# Altium schematic sheet 7seg.SchDoc
size A4
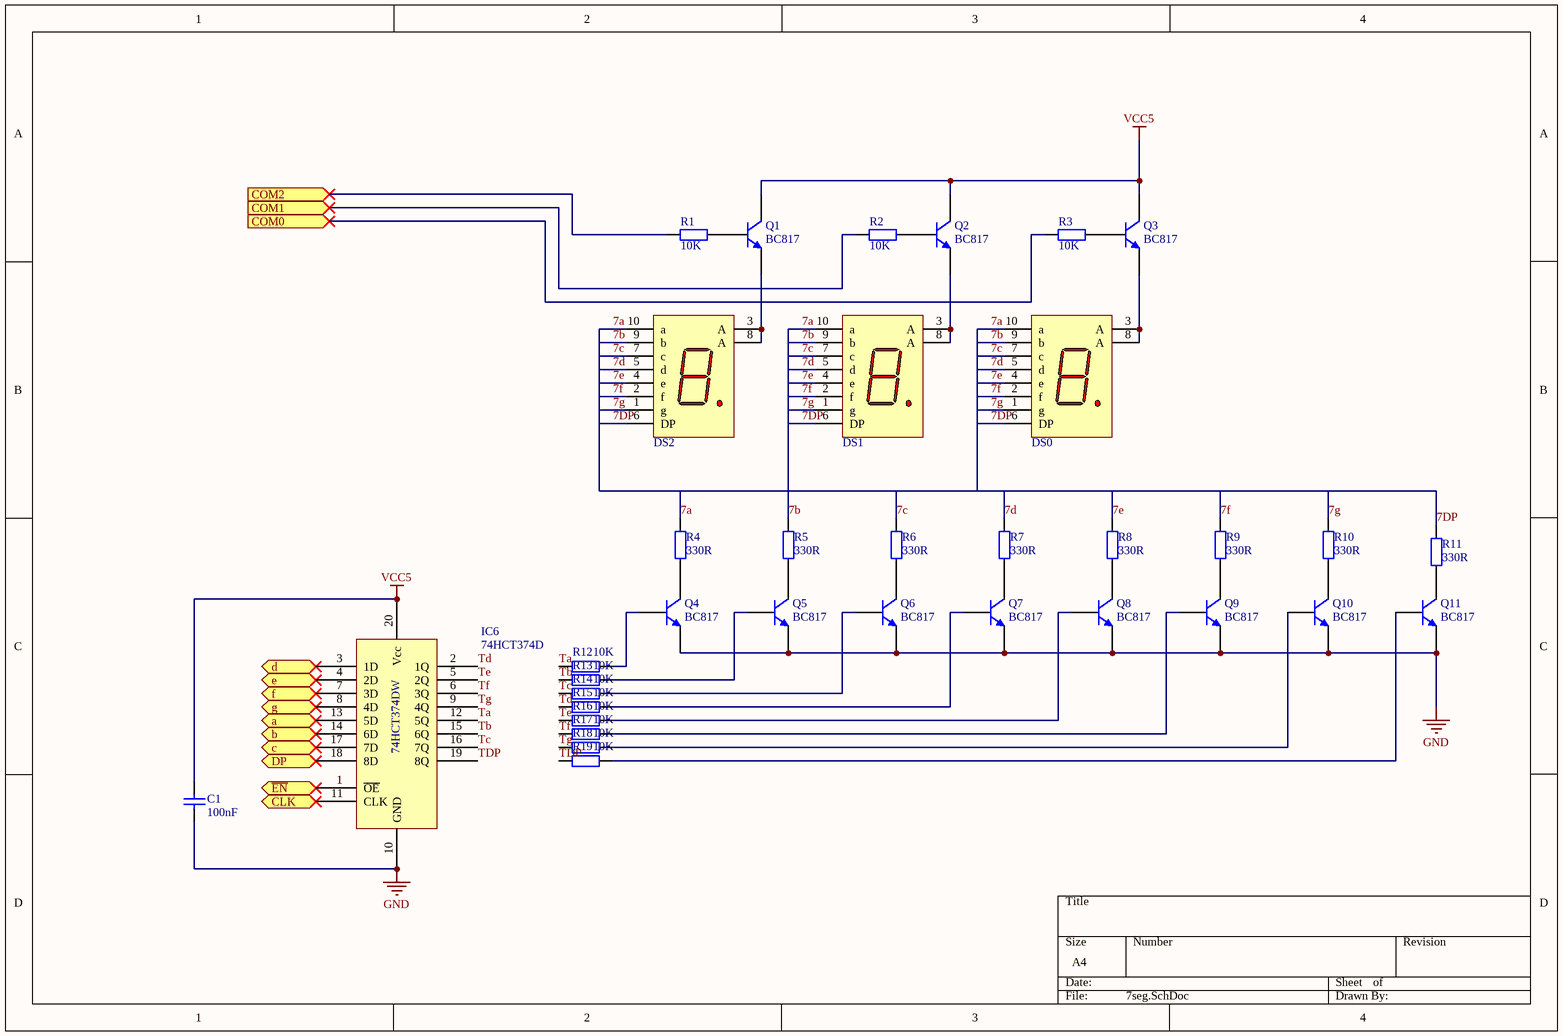
[diagram p0: 7seg.SchDoc]

## Parts
C1  100nF  [FP_0805_CAP_085]
DS0  7SEG  [FP_7SEG]  (value not drawn)
DS1  7SEG  [FP_7SEG]  (value not drawn)
DS2  7SEG  [FP_7SEG]  (value not drawn)
IC6  74HCT374D  [SOP20]
Q1  BC817  [FP_SOT23-3]
Q2  BC817  [FP_SOT23-3]
Q3  BC817  [FP_SOT23-3]
Q4  BC817  [FP_SOT23-3]
Q5  BC817  [FP_SOT23-3]
Q6  BC817  [FP_SOT23-3]
Q7  BC817  [FP_SOT23-3]
Q8  BC817  [FP_SOT23-3]
Q9  BC817  [FP_SOT23-3]
Q10  BC817  [FP_SOT23-3]
Q11  BC817  [FP_SOT23-3]
R1  10K  [FP_0805_RES]
R2  10K  [FP_0805_RES]
R3  10K  [FP_0805_RES]
R4  330R  [FP_0805_RES]
R5  330R  [FP_0805_RES]
R6  330R  [FP_0805_RES]
R7  330R  [FP_0805_RES]
R8  330R  [FP_0805_RES]
R9  330R  [FP_0805_RES]
R10  330R  [FP_0805_RES]
R11  330R  [FP_0805_RES]
R12  10K  [FP_0805_RES]
R13  10K  [FP_0805_RES]
R14  10K  [FP_0805_RES]
R15  10K  [FP_0805_RES]
R16  10K  [FP_0805_RES]
R17  10K  [FP_0805_RES]
R18  10K  [FP_0805_RES]
R19  10K  [FP_0805_RES]

## Ports
a (in), b (in), c (in), CLK (in), COM0 (in), COM1 (in), COM2 (in), d (in), DP (in), e (in), f (in), g (in), ~{EN} (in)

## Nets
GND: C1.1 IC6.10(GND) Q4.1(E) Q5.1(E) Q6.1(E) Q7.1(E) Q8.1(E) Q9.1(E) Q10.1(E) Q11.1(E)
VCC5: C1.2 IC6.20(Vcc) Q1.3(C) Q2.3(C) Q3.3(C)
7a: DS0.10(a) DS1.10(a) DS2.10(a) R4.2
7b: DS0.9(b) DS1.9(b) DS2.9(b) R5.2
7c: DS0.7(c) DS1.7(c) DS2.7(c) R6.2
7d: DS0.5(d) DS1.5(d) DS2.5(d) R7.2
7DP: DS0.6(DP) DS1.6(DP) DS2.6(DP) R11.2
7e: DS0.4(e) DS1.4(e) DS2.4(e) R8.2
7f: DS0.2(f) DS1.2(f) DS2.2(f) R9.2
7g: DS0.1(g) DS1.1(g) DS2.1(g) R10.2
a: IC6.13(5D) ; port a
b: IC6.14(6D) ; port b
c: IC6.17(7D) ; port c
CLK: IC6.11(CLK) ; port CLK
COM0: R3.1 ; port COM0
COM1: R2.1 ; port COM1
COM2: R1.1 ; port COM2
d: IC6.3(1D) ; port d
DP: IC6.18(8D) ; port DP
e: IC6.4(2D) ; port e
~{EN}: IC6.1(~{OE}) ; port ~{EN}
f: IC6.7(3D) ; port f
g: IC6.8(4D) ; port g
Ta: IC6.12(5Q) R12.1
Tb: IC6.15(6Q) R13.1
Tc: IC6.16(7Q) R14.1
Td: IC6.2(1Q) R15.1
TDP: IC6.19(8Q) R19.1
Te: IC6.5(2Q) R16.1
Tf: IC6.6(3Q) R17.1
Tg: IC6.9(4Q) R18.1
NetDS0_3: DS0.3(A) DS0.8(A) Q3.1(E)
NetDS1_3: DS1.3(A) DS1.8(A) Q2.1(E)
NetDS2_3: DS2.3(A) DS2.8(A) Q1.1(E)
NetQ1_2: Q1.2(B) R1.2
NetQ2_2: Q2.2(B) R2.2
NetQ3_2: Q3.2(B) R3.2
NetQ4_2: Q4.2(B) R12.2
NetQ4_3: Q4.3(C) R4.1
NetQ5_2: Q5.2(B) R13.2
NetQ5_3: Q5.3(C) R5.1
NetQ6_2: Q6.2(B) R14.2
NetQ6_3: Q6.3(C) R6.1
NetQ7_2: Q7.2(B) R15.2
NetQ7_3: Q7.3(C) R7.1
NetQ8_2: Q8.2(B) R16.2
NetQ8_3: Q8.3(C) R8.1
NetQ9_2: Q9.2(B) R17.2
NetQ9_3: Q9.3(C) R9.1
NetQ10_2: Q10.2(B) R18.2
NetQ10_3: Q10.3(C) R10.1
NetQ11_2: Q11.2(B) R19.2
NetQ11_3: Q11.3(C) R11.1

## Notes on the sheet
- (in symbol 74HCT374D) 74HCT374DW

## Library data of the parts
C1 = CAP 100nF: Capacitor; Tolerance: +80%/-20%; Voltage: 25V; Reference: 1759167; Name: SMD Multilayer Ceramic Capacitor, 0805; Supplier: Farnell; Value: 100nF
DS0-DS2 = 7SEG: Common Anode 7 Segment Display; Name: FYS-3911BUHR-21 (FYL) 7 SEG SRED COM.AN.; Reference: 35-03-94; Supplier: Lomex
IC6 = 74HCT374D: Name: D Flip-Flop, Tri State Non Inverted, Positive Edge; Reference: 1085316; Link: http://hu.farnell.com/nxp/74hct374d/74hct-cmos-smd-74hct374-soic20/dp/1085316?MER=sy-me-pd-mi-alte; Supplier: Farnell
Q1-Q11 = BC817: NPN Transistor; pin to pad: 1>2 2>1; Reference: 1081224; Name: BC817-25,215  Bipolar (BJT) Single Transistor, General Purpose, NPN, 45 V, 100 MHz; Supplier: Farnell
R1-R3 R12-R19 = RES 10K: Resistor; Tolerance: 5%; Power: 125mW; Name: YAGEO (PHYCOMP)  RC0805JR-0710KL  SMD Chip Resistor, Thick Film, 10 kohm; Reference: 9234136; Supplier: Farnell; Value: 10K
R4-R11 = RES 330R: Resistor; Tolerance: 5%; Power: 125mW; Name: YAGEO (PHYCOMP)  RC0805JR-07330RL  SMD Chip Resistor, Thick Film, 330 ohm; Reference: 9233946; Supplier: Farnell; Value: 330R